# EAGLE design Snow_Melt_Map_2 (EAGLE 9.6.2)
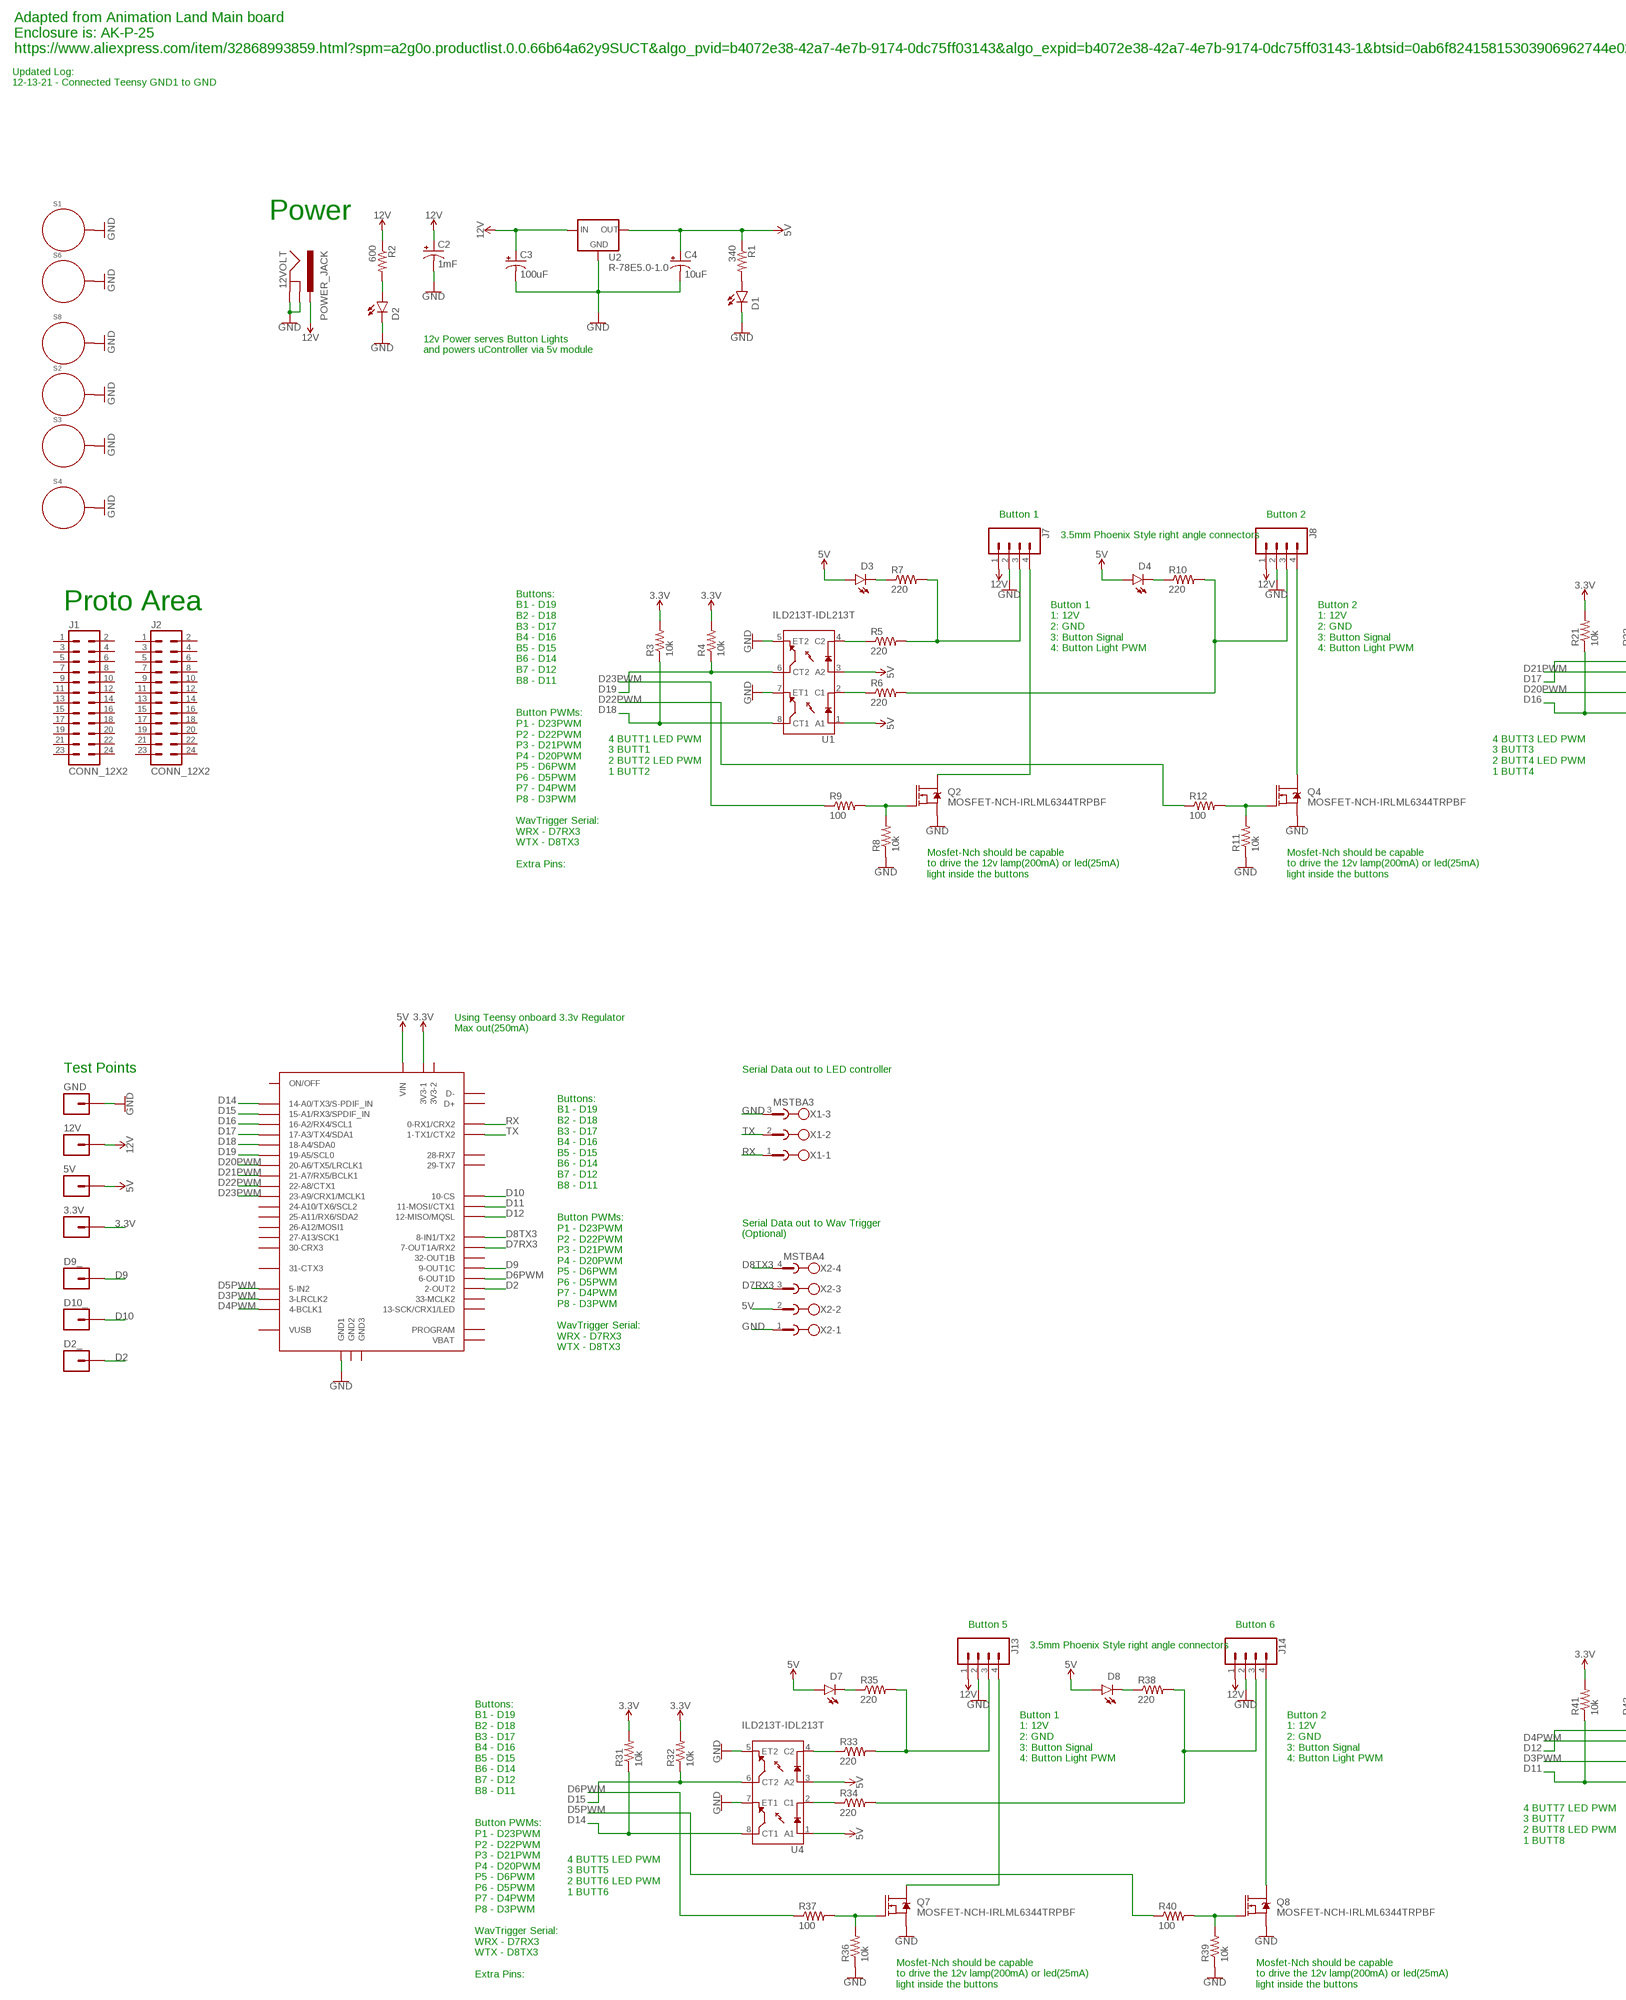
[diagram p0: schematic, sheet 1, part 1 of 2]
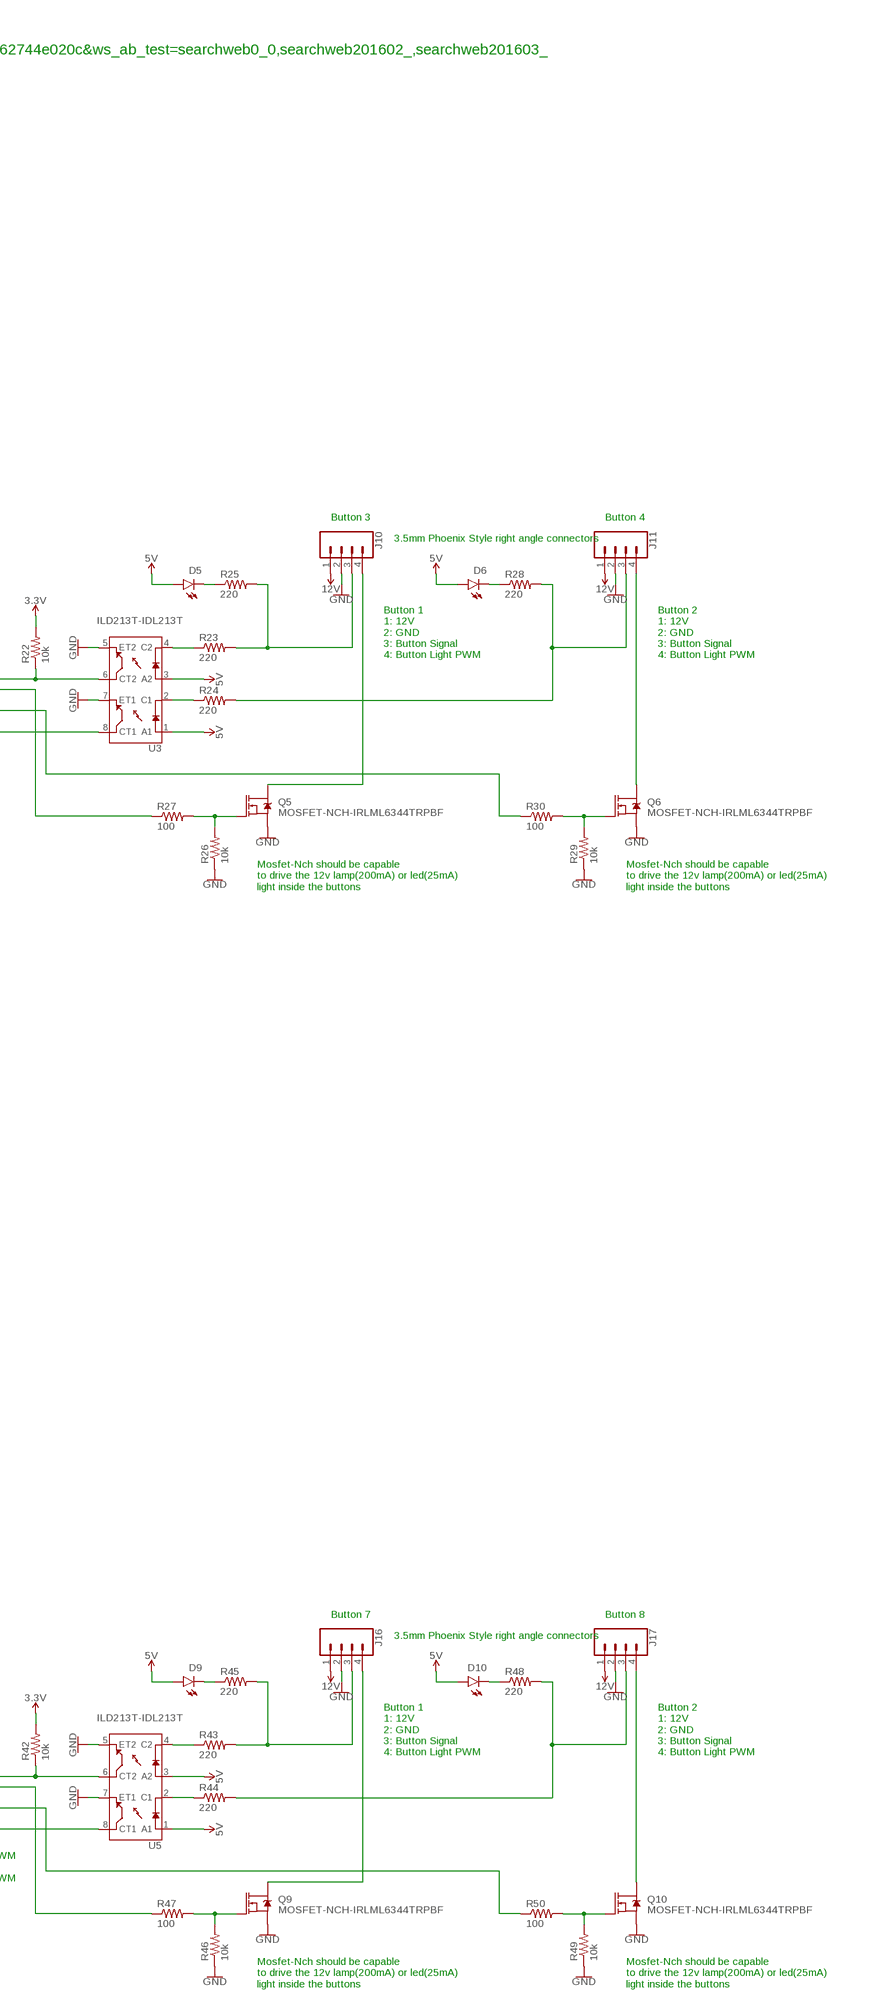
[diagram p1: schematic, sheet 1, part 2 of 2]

## Parts
3.3V  M01PTH  [1X01]
5V  M01PTH  [1X01]
12V  M01PTH  [1X01]
12VOLT  POWER_JACK  [POWER_JACK_PTH]
C2  1mF  1000UF-RADIAL-5MM-25V-20%  [CPOL-RADIAL-5MM-10MM]
C3  100uF  100UF-POLAR-RADIAL-2.5MM-25V-20%  [CPOL-RADIAL-2.5MM-6.5MM]
C4  10uF  10UF-POLAR-RADIAL-2.5MM-KIT-25V-20%  [CPOL-RADIAL-2.5MM-5MM-KIT]
D1  RED  LED-RED1206  [LED-1206]
D2  RED  LED-RED1206  [LED-1206]
D2_  M01PTH  [1X01]
D3  RED  LED-RED1206  [LED-1206]
D4  RED  LED-RED1206  [LED-1206]
D5  RED  LED-RED1206  [LED-1206]
D6  RED  LED-RED1206  [LED-1206]
D7  RED  LED-RED1206  [LED-1206]
D8  RED  LED-RED1206  [LED-1206]
D9  RED  LED-RED1206  [LED-1206]
D9_  M01PTH  [1X01]
D10  RED  LED-RED1206  [LED-1206]
D10_  M01PTH  [1X01]
GND  M01PTH  [1X01]
J1  CONN_12X2  [2X12]
J2  CONN_12X2  [2X12]
J7  CONN_043.5MM_RA  [1X04_3.5MM_RA]
J8  CONN_043.5MM_RA  [1X04_3.5MM_RA]
J10  CONN_043.5MM_RA  [1X04_3.5MM_RA]
J11  CONN_043.5MM_RA  [1X04_3.5MM_RA]
J13  CONN_043.5MM_RA  [1X04_3.5MM_RA]
J14  CONN_043.5MM_RA  [1X04_3.5MM_RA]
J16  CONN_043.5MM_RA  [1X04_3.5MM_RA]
J17  CONN_043.5MM_RA  [1X04_3.5MM_RA]
Q2  MOSFET-NCH-IRLML6344TRPBF  [SOT23-3]
Q4  MOSFET-NCH-IRLML6344TRPBF  [SOT23-3]
Q5  MOSFET-NCH-IRLML6344TRPBF  [SOT23-3]
Q6  MOSFET-NCH-IRLML6344TRPBF  [SOT23-3]
Q7  MOSFET-NCH-IRLML6344TRPBF  [SOT23-3]
Q8  MOSFET-NCH-IRLML6344TRPBF  [SOT23-3]
Q9  MOSFET-NCH-IRLML6344TRPBF  [SOT23-3]
Q10  MOSFET-NCH-IRLML6344TRPBF  [SOT23-3]
R1  340  R-US_R0805  [R0805]
R2  600  R-US_R0805  [R0805]
R3  10k  R-US_R0805  [R0805]
R4  10k  R-US_R0805  [R0805]
R5  220  R-US_R0805  [R0805]
R6  220  R-US_R0805  [R0805]
R7  220  R-US_R0805  [R0805]
R8  10k  R-US_R0805  [R0805]
R9  100  R-US_R0805  [R0805]
R10  220  R-US_R0805  [R0805]
R11  10k  R-US_R0805  [R0805]
R12  100  R-US_R0805  [R0805]
R21  10k  R-US_R0805  [R0805]
R22  10k  R-US_R0805  [R0805]
R23  220  R-US_R0805  [R0805]
R24  220  R-US_R0805  [R0805]
R25  220  R-US_R0805  [R0805]
R26  10k  R-US_R0805  [R0805]
R27  100  R-US_R0805  [R0805]
R28  220  R-US_R0805  [R0805]
R29  10k  R-US_R0805  [R0805]
R30  100  R-US_R0805  [R0805]
R31  10k  R-US_R0805  [R0805]
R32  10k  R-US_R0805  [R0805]
R33  220  R-US_R0805  [R0805]
R34  220  R-US_R0805  [R0805]
R35  220  R-US_R0805  [R0805]
R36  10k  R-US_R0805  [R0805]
R37  100  R-US_R0805  [R0805]
R38  220  R-US_R0805  [R0805]
R39  10k  R-US_R0805  [R0805]
R40  100  R-US_R0805  [R0805]
R41  10k  R-US_R0805  [R0805]
R42  10k  R-US_R0805  [R0805]
R43  220  R-US_R0805  [R0805]
R44  220  R-US_R0805  [R0805]
R45  220  R-US_R0805  [R0805]
R46  10k  R-US_R0805  [R0805]
R47  100  R-US_R0805  [R0805]
R48  220  R-US_R0805  [R0805]
R49  10k  R-US_R0805  [R0805]
R50  100  R-US_R0805  [R0805]
S1  STANDOFF_ELECTRICAL5-32  [STANDOFF_ELECTRICAL_5_32]
S2  STANDOFF_ELECTRICAL5-32  [STANDOFF_ELECTRICAL_5_32]
S3  STANDOFF_ELECTRICAL5-32  [STANDOFF_ELECTRICAL_5_32]
S4  STANDOFF_ELECTRICAL5-32  [STANDOFF_ELECTRICAL_5_32]
S6  STANDOFF_ELECTRICAL5-32  [STANDOFF_ELECTRICAL_5_32]
S8  STANDOFF_ELECTRICAL5-32  [STANDOFF_ELECTRICAL_5_32]
U1  ILD213T-IDL213T  [SO08]
U2  R-78E5.0-1.0  [DC-DC_CONVERTER_78XX]
U3  ILD213T-IDL213T  [SO08]
U4  ILD213T-IDL213T  [SO08]
U5  ILD213T-IDL213T  [SO08]
U$1  TEENSY40  [TEENSY40]
X1  MSTBA3  [MSTBA3]
X2  MSTBA4  [MSTBA4]

## Nets
3.3V: 3.3V.1 R3.2 R4.2 R21.2 R22.2 R31.2 R32.2 R41.2 R42.2 U$1.3V3-1
5V: 5V.1 C4.1(+) D3.A D4.A D5.A D6.A D7.A D8.A D9.A D10.A R1.1 U1.1(A1) U1.3(A2) U2.VOUT(OUT) U3.1(A1) U3.3(A2) U4.1(A1) U4.3(A2) U5.1(A1) U5.3(A2) U$1.VIN X2.2
12V: 12V.1 12VOLT.PWR C2.+ C3.1(+) J7.1 J8.1 J10.1 J11.1 J13.1 J14.1 J16.1 J17.1 R2.1 U2.VIN(IN)
D2: D2_.1 U$1.2-OUT2
D3PWM: R50.1 U$1.3-LRCLK2
D4PWM: R47.1 U$1.4-BCLK2(4-BCLK1)
D5PWM: R40.1 U$1.5-IN2
D6PWM: R37.1 U$1.6-OUT1D
D7RX3: U$1.7-RX2/OUT1A(7-OUT1A/RX2) X2.3
D8TX3: U$1.8-TX2/IN1(8-IN1/TX2) X2.4
D9: D9_.1 U$1.9-OUT1C
D10: D10_.1 U$1.10-CS/MQSR(10-CS)
D11: R41.1 U5.8(CT1) U$1.11-MOSI/CTX1
D12: R42.1 U5.6(CT2) U$1.12-MIO/MQSL(12-MISO/MQSL)
D14: R31.1 U4.8(CT1) U$1.14-A0/TX3/S-PFI_OUT(14-A0/TX3/S-PDIF_IN)
D15: R32.1 U4.6(CT2) U$1.15-A1/RX3/S-PDIF_IN(15-A1/RX3/SPDIF_IN)
D16: R21.1 U3.8(CT1) U$1.16-A2/RX4/SCL1
D17: R22.1 U3.6(CT2) U$1.17-A3/TX4/SDA1
D18: R3.1 U1.8(CT1) U$1.18-A4/SDA0
D19: R4.1 U1.6(CT2) U$1.19-A5/SCL0
D20PWM: R30.1 U$1.20-A6/TX5/LRCLK1
D21PWM: R27.1 U$1.21-A7/RX5/BCLK1
D22PWM: R12.1 U$1.22-A8/CTX1
D23PWM: R9.1 U$1.23-A9/CRX1/CCLK1(23-A9/CRX1/MCLK1)
GND: 12VOLT.GND 12VOLT.GNDBREAK C2.- C3.2(-) C4.2(-) D1.C D2.C GND.1 J7.2 J8.2 J10.2 J11.2 J13.2 J14.2 J16.2 J17.2 Q2.2(S) Q4.2(S) Q5.2(S) Q6.2(S) Q7.2(S) Q8.2(S) Q9.2(S) Q10.2(S) R8.1 R11.1 R26.1 R29.1 R36.1 R39.1 R46.1 R49.1 S1.P1 S2.P1 S3.P1 S4.P1 S6.P1 S8.P1 U1.5(ET2) U1.7(ET1) U2.GND U3.5(ET2) U3.7(ET1) U4.5(ET2) U4.7(ET1) U5.5(ET2) U5.7(ET1) U$1.GND1 X1.3 X2.1
N$2: D1.A R1.2
N$3: D2.A R2.2
N$5: J7.3 R5.2 R7.2
N$6: D3.C R7.1
N$7: R5.1 U1.4(C2)
N$8: R6.1 U1.2(C1)
N$10: Q2.1(G) R8.2 R9.2
N$11: J7.4 Q2.3(D)
N$12: J8.3 R6.2 R10.2
N$18: D4.C R10.1
N$25: Q4.1(G) R11.2 R12.2
N$28: J8.4 Q4.3(D)
N$31: J10.3 R23.2 R25.2
N$32: D5.C R25.1
N$33: R23.1 U3.4(C2)
N$34: R24.1 U3.2(C1)
N$35: Q5.1(G) R26.2 R27.2
N$36: J10.4 Q5.3(D)
N$37: J11.3 R24.2 R28.2
N$38: D6.C R28.1
N$39: Q6.1(G) R29.2 R30.2
N$42: J11.4 Q6.3(D)
N$45: J13.3 R33.2 R35.2
N$46: D7.C R35.1
N$47: R33.1 U4.4(C2)
N$48: R34.1 U4.2(C1)
N$49: Q7.1(G) R36.2 R37.2
N$50: J13.4 Q7.3(D)
N$51: J14.3 R34.2 R38.2
N$52: D8.C R38.1
N$53: Q8.1(G) R39.2 R40.2
N$56: J14.4 Q8.3(D)
N$59: J16.3 R43.2 R45.2
N$60: D9.C R45.1
N$61: R43.1 U5.4(C2)
N$62: R44.1 U5.2(C1)
N$63: Q9.1(G) R46.2 R47.2
N$64: J16.4 Q9.3(D)
N$65: J17.3 R44.2 R48.2
N$66: D10.C R48.1
N$67: Q10.1(G) R49.2 R50.2
N$70: J17.4 Q10.3(D)
RX: U$1.0-RX1(0-RX1/CRX2) X1.1
TX: U$1.1-TX1(1-TX1/CTX2) X1.2
Unconnected: J1.1 J1.2 J1.3 J1.4 J1.5 J1.6 J1.7 J1.8 J1.9 J1.10 J1.11 J1.12 J1.13 J1.14 J1.15 J1.16 J1.17 J1.18 J1.19 J1.20 J1.21 J1.22 J1.23 J1.24 J2.1 J2.2 J2.3 J2.4 J2.5 J2.6 J2.7 J2.8 J2.9 J2.10 J2.11 J2.12 J2.13 J2.14 J2.15 J2.16 J2.17 J2.18 J2.19 J2.20 J2.21 J2.22 J2.23 J2.24 U$1.3V3-2 U$1.13-SCK/CRX1/LED U$1.24-A10/TX6/SCL2 U$1.25-A11/SDA2(25-A11/RX6/SDA2) U$1.26-A12/MOSI1 U$1.27-A13/SCK1 U$1.28-RX7 U$1.29-TX7 U$1.30-CRX3 U$1.31-CTX3 U$1.32-OUTB1(32-OUT1B) U$1.33-MCLK2 U$1.D+ U$1.D- U$1.GND2 U$1.GND3 U$1.ON/OFF U$1.PROGRAM U$1.VBAT U$1.VUSB

## Notes on the sheet
- Adapted from Animation Land Main board
  Enclosure is: AK-P-25
  https://www.aliexpress.com/item/32868993859.html?spm=a2g0o.productlist.0.0.66b64a62y9SUCT&algo_pvid=b4072e38-42a7-4e7b-9174-0dc75ff03143&algo_expid=b4072e38-42a7-4e7b-9174-0dc75ff03143-1&btsid=0ab6f82415815303906962744e020c&ws_ab_test=searchweb0_0,searchweb201602_,searchweb201603_
- Updated Log:
  12-13-21 - Connected Teensy GND1 to GND
- Power
- 12v Power serves Button Lights
  and powers uController via 5v module
- Button 3 | Button 4
- Button 1 | Button 2
- 3.5mm Phoenix Style right angle connectors
- 3.5mm Phoenix Style right angle connectors
- Proto Area
- Button 1
  1: 12V
  2: GND
  3: Button Signal
  4: Button Light PWM
- Button 2
  1: 12V
  2: GND
  3: Button Signal
  4: Button Light PWM
- Button 1
  1: 12V
  2: GND
  3: Button Signal
  4: Button Light PWM
- Button 2
  1: 12V
  2: GND
  3: Button Signal
  4: Button Light PWM
- 4 BUTT1 LED PWM
  3 BUTT1
  2 BUTT2 LED PWM
  1 BUTT2
- 4 BUTT3 LED PWM
  3 BUTT3
  2 BUTT4 LED PWM
  1 BUTT4
- Buttons:
  B1 - D19
  B2 - D18
  B3 - D17
  B4 - D16
  B5 - D15
  B6 - D14
  B7 - D12
  B8 - D11
  
  
  Button PWMs:
  P1 - D23PWM
  P2 - D22PWM
  P3 - D21PWM
  P4 - D20PWM
  P5 - D6PWM
  P6 - D5PWM
  P7 - D4PWM
  P8 - D3PWM
  
  WavTrigger Serial:
  WRX - D7RX3
  WTX - D8TX3
  
  Extra Pins:
- Mosfet-Nch should be capable
  to drive the 12v lamp(200mA) or led(25mA)
  light inside the buttons
- Mosfet-Nch should be capable
  to drive the 12v lamp(200mA) or led(25mA)
  light inside the buttons
- Mosfet-Nch should be capable
  to drive the 12v lamp(200mA) or led(25mA)
  light inside the buttons
- Mosfet-Nch should be capable
  to drive the 12v lamp(200mA) or led(25mA)
  light inside the buttons
- Using Teensy onboard 3.3v Regulator 
  Max out(250mA)
- Test Points | Serial Data out to LED controller
- Serial Data out to Wav Trigger
  (Optional)
- Buttons:
  B1 - D19
  B2 - D18
  B3 - D17
  B4 - D16
  B5 - D15
  B6 - D14
  B7 - D12
  B8 - D11
  
  
  Button PWMs:
  P1 - D23PWM
  P2 - D22PWM
  P3 - D21PWM
  P4 - D20PWM
  P5 - D6PWM
  P6 - D5PWM
  P7 - D4PWM
  P8 - D3PWM
  
  WavTrigger Serial:
  WRX - D7RX3
  WTX - D8TX3
- Button 7 | Button 8
- 3.5mm Phoenix Style right angle connectors
- Button 5 | Button 6
- 3.5mm Phoenix Style right angle connectors
- Button 1
  1: 12V
  2: GND
  3: Button Signal
  4: Button Light PWM
- Button 2
  1: 12V
  2: GND
  3: Button Signal
  4: Button Light PWM
- Button 1
  1: 12V
  2: GND
  3: Button Signal
  4: Button Light PWM
- Button 2
  1: 12V
  2: GND
  3: Button Signal
  4: Button Light PWM
- 4 BUTT7 LED PWM
  3 BUTT7
  2 BUTT8 LED PWM
  1 BUTT8
- 4 BUTT5 LED PWM
  3 BUTT5
  2 BUTT6 LED PWM
  1 BUTT6
- Mosfet-Nch should be capable
  to drive the 12v lamp(200mA) or led(25mA)
  light inside the buttons
- Mosfet-Nch should be capable
  to drive the 12v lamp(200mA) or led(25mA)
  light inside the buttons
- Buttons:
  B1 - D19
  B2 - D18
  B3 - D17
  B4 - D16
  B5 - D15
  B6 - D14
  B7 - D12
  B8 - D11
  
  
  Button PWMs:
  P1 - D23PWM
  P2 - D22PWM
  P3 - D21PWM
  P4 - D20PWM
  P5 - D6PWM
  P6 - D5PWM
  P7 - D4PWM
  P8 - D3PWM
  
  WavTrigger Serial:
  WRX - D7RX3
  WTX - D8TX3
  
  Extra Pins:
- Mosfet-Nch should be capable
  to drive the 12v lamp(200mA) or led(25mA)
  light inside the buttons
- Mosfet-Nch should be capable
  to drive the 12v lamp(200mA) or led(25mA)
  light inside the buttons

## Library data of the parts
3.3V 5V 12V D2_ D9_ D10_ GND = SparkFun-Connectors:M01: Header 1 Standard 1-pin 0.1" header. Use with straight break away headers (SKU : PRT-00116), right angle break away headers (PRT-00553), swiss pins (PRT-00743), machine pins (PRT-00117), and female headers (PRT-00115). SMTSO-256-ET is a "flush mount" nut for a 4-40 screw. The older package used to be too tight, and did not allow it to sit properly thru the drill hit. The latest (0.165DIA) fits nice and snug.
12VOLT = SparkFun-Connectors:POWER_JACK: Power Jack Connector This is the standard 5.5mm barrel jack for power. The PTH is the most common, proven, reliable, footprint. The Slot footprint only works if the mill layer is transmitted to the PCB fab house so be warned. Here are the connectors we sell at SparkFun: DC Barrel Power Jack/Connector <https://www.sparkfun.com/products/119> (PRT-00119) DC Barrel Power Jack/Connector (SMD) <https://www.sparkfun.com/products/12748> (PRT-12748) DC Barrel Jack Adapter - Breadboard Compatible <https://www.sparkfun.com/products/10811> (PRT-10811) It is used on this SparkFun product (and many, many others): SparkFun RedBoard - Programmed with Arduino <https://www.sparkfun.com/products/12757> (DEV-12757) Also, if you need a mating power supply or connector, please check these out: Wall Adapter Power Supply - 9VDC 650mA <https://www.sparkfun.com/products/298> (TOL-00298) DC Barrel Jack Adapter - Male <https://www.sparkfun.com/products/10287> (PRT-10287); PROD_ID: CONN-08197
C2 = SparkFun-Capacitors:1000UF: 1,000µF/1mF ceramic capacitors A capacitor is a passive two-terminal electrical component used to store electrical energy temporarily in an electric field. CAP-08070; PROD_ID: CAP-09538
C3 = SparkFun-Capacitors:100UF-POLAR: 100µF polarized capacitors A capacitor is a passive two-terminal electrical component used to store electrical energy temporarily in an electric field.; PROD_ID: CAP-08439
C4 = SparkFun-Capacitors:10UF-POLAR: 10.0µF polarized capacitors A capacitor is a passive two-terminal electrical component used to store electrical energy temporarily in an electric field.; PROD_ID: CAP-08440
D1-D10 = SparkFun-LED:LED-RED: Red SMD LED Used in manufacturing of most products at SparkFun Packages: 0603 - SMD 0603 package [Product Link] <http://docs.avagotech.com/docs/AV02-0551EN> 0603 SMART - SMD 0603 SMART package ( more efficient and expensive)[Product Link] <http://www.osram-os.com/Graphics/XPic2/00077099_0.pdf> 1206 - SMD1206 package [Product Link] <https://www.sparkfun.com/datasheets/DevTools/LilyPad/Q150OVS4.pdff> SparkFun Products: Pro Mini 328 -5V <https://www.sparkfun.com/products/821> RedBoard <https://www.sparkfun.com/products/12757> IOIO-OTG <https://www.sparkfun.com/products/13613>; PROD_ID: DIO-09912
J1 J2 = SparkFun-Connectors:CONN_12X2: Multi connection point. Often used as Generic Header-pin footprint for 0.1 inch spaced/style header connections On any of the 0.1 inch spaced packages, you can populate with these: Break Away Headers - Straight <https://www.sparkfun.com/products/116> (PRT-00116) Break Away Male Headers - Right Angle <https://www.sparkfun.com/products/553> (PRT-00553) Female Headers <https://www.sparkfun.com/products/115> (PRT-00115) Break Away Headers - Machine Pin <https://www.sparkfun.com/products/117> (PRT-00117) Break Away Female Headers - Swiss Machine Pin <https://www.sparkfun.com/products/743> (PRT-00743)
J7 J8 J10 J11 J13 J14 J16 J17 = th_libraries:CONN_04: Multi connection point. Often used as Generic Header-pin footprint for 0.1 inch spaced/style header connections On any of the 0.1 inch spaced packages, you can populate with these: Break Away Headers - Straight <https://www.sparkfun.com/products/116> (PRT-00116) Break Away Male Headers - Right Angle <https://www.sparkfun.com/products/553> (PRT-00553) Female Headers <https://www.sparkfun.com/products/115> (PRT-00115) Break Away Headers - Machine Pin <https://www.sparkfun.com/products/117> (PRT-00117) Break Away Female Headers - Swiss Machine Pin <https://www.sparkfun.com/products/743> (PRT-00743) For SCREWTERMINALS and SPRING TERMINALS visit here: Screw Terimnals on SparkFun.com <https://www.sparkfun.com/search/results?term=Screw+Terminals> (5mm/3.5mm/2.54mm spacing) This device is also useful as a general connection point to wire up your design to another part of your project. Our various solder wires solder well into these plated through hole pads. Hook-Up Wire - Assortment (Stranded, 22 AWG) <https://www.sparkfun.com/products/11375> (PRT-11375) Hook-Up Wire - Assortment (Solid Core, 22 AWG) <https://www.sparkfun.com/products/11367> (PRT-11367) View the entire wire category on our website here <https://www.sparkfun.com/categories/141> Special notes: Molex polarized connector foot print use with SKU : PRT-08231 with associated crimp pins and housings. 1MM SMD Version SKU: PRT-10208
Q2 Q4-Q10 = th_libraries:MOSFET-NCH: N-channel MOSFETs from Sparkfun-DiscreteSemi Library; DESC: 5.0A/29mOhm/30V/2.5V drv capable
R1-R12 R21-R50 = rcl:R-US_: RESISTOR, American symbol; SPICEPREFIX: R
S1-S4 S6 S8 = th_libraries:STANDOFF_ELECTRICAL: A standoff intended to be an electrically connected point. Pad size and stop size allow for a #8 Phillips pan screw head to make a solid connection to the board. Added 144mill drill hole that fits my normal wood screw
U1 U3-U5 = th_libraries:ILD213T: Dual Channel Phototransistor Optocoupler Dual Channel 70 V 4000 Vrms Phototransistor Optocoupler in a standard SOIC-8 package. Used to couple signals between electrically isolated circuits. Datasheet <https://www.sparkfun.com/datasheets/Components/SMD/ild205t.pdf> SparkFun Products: SparkFun Opto-Isolator Breakout <https://www.sparkfun.com/products/9118>; PROD_ID: IC-09076
U2 = SparkFun-IC-Power:R-78E5.0-1.0: Recom Power 5V 1A DC/DC Converter The Recom R-78E5.0-X.X is a compact DC/DC converter module that is a pin for pin drop-in replacement for the LM7805 linear voltage regulator. Specifications: Input Range: 7-28V Output Voltage: 5V Output Current: 1A Max Efficiency: 91% Datasheet <https://www.recom-power.com/pdf/Innoline/R-78Exx-1.0.pdf>; PROD_ID: COM-13655
U$1 = th_libraries:TEENSY40: Teensy 4.0 device including POGO pins for pins 24 - 33, but not yet pins for D+ and D-. Symbol layout is what works for me and may not suite everyone... that can be added or additional symbols can be created to be used in a modilied davie name.
X1 = th_libraries:MSTBA3: PHOENIX; MF: FARNELL; MPN: 1757255; OC_FARNELL: 3705183; OC_NEWARK: 71C4162
X2 = th_libraries:MSTBA4: PHOENIX; MF: FARNELL; MPN: 1757268; OC_FARNELL: 3705195; OC_NEWARK: 71C4163

## Board
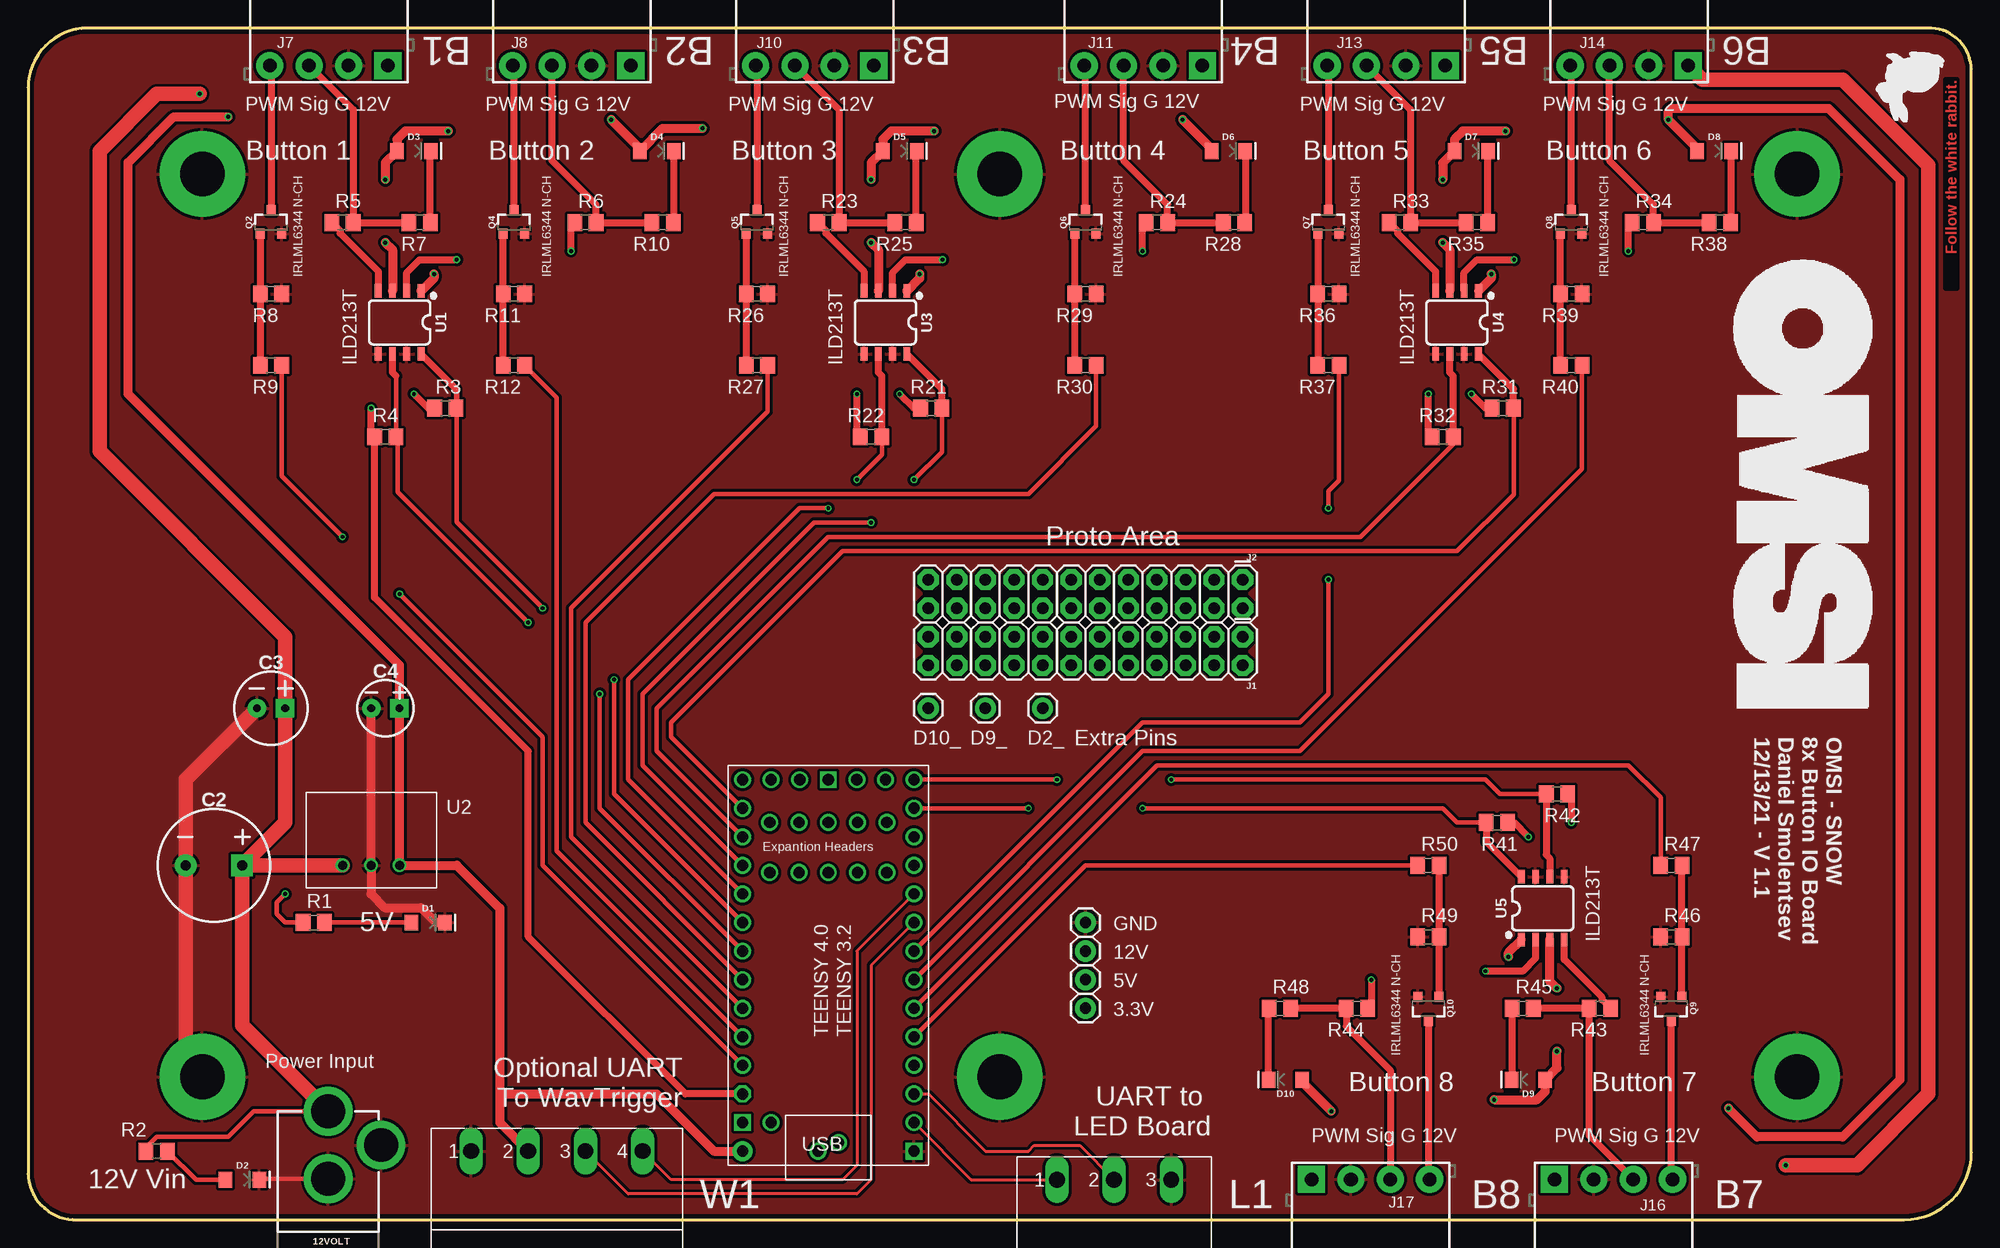
[diagram p2: board, top side]
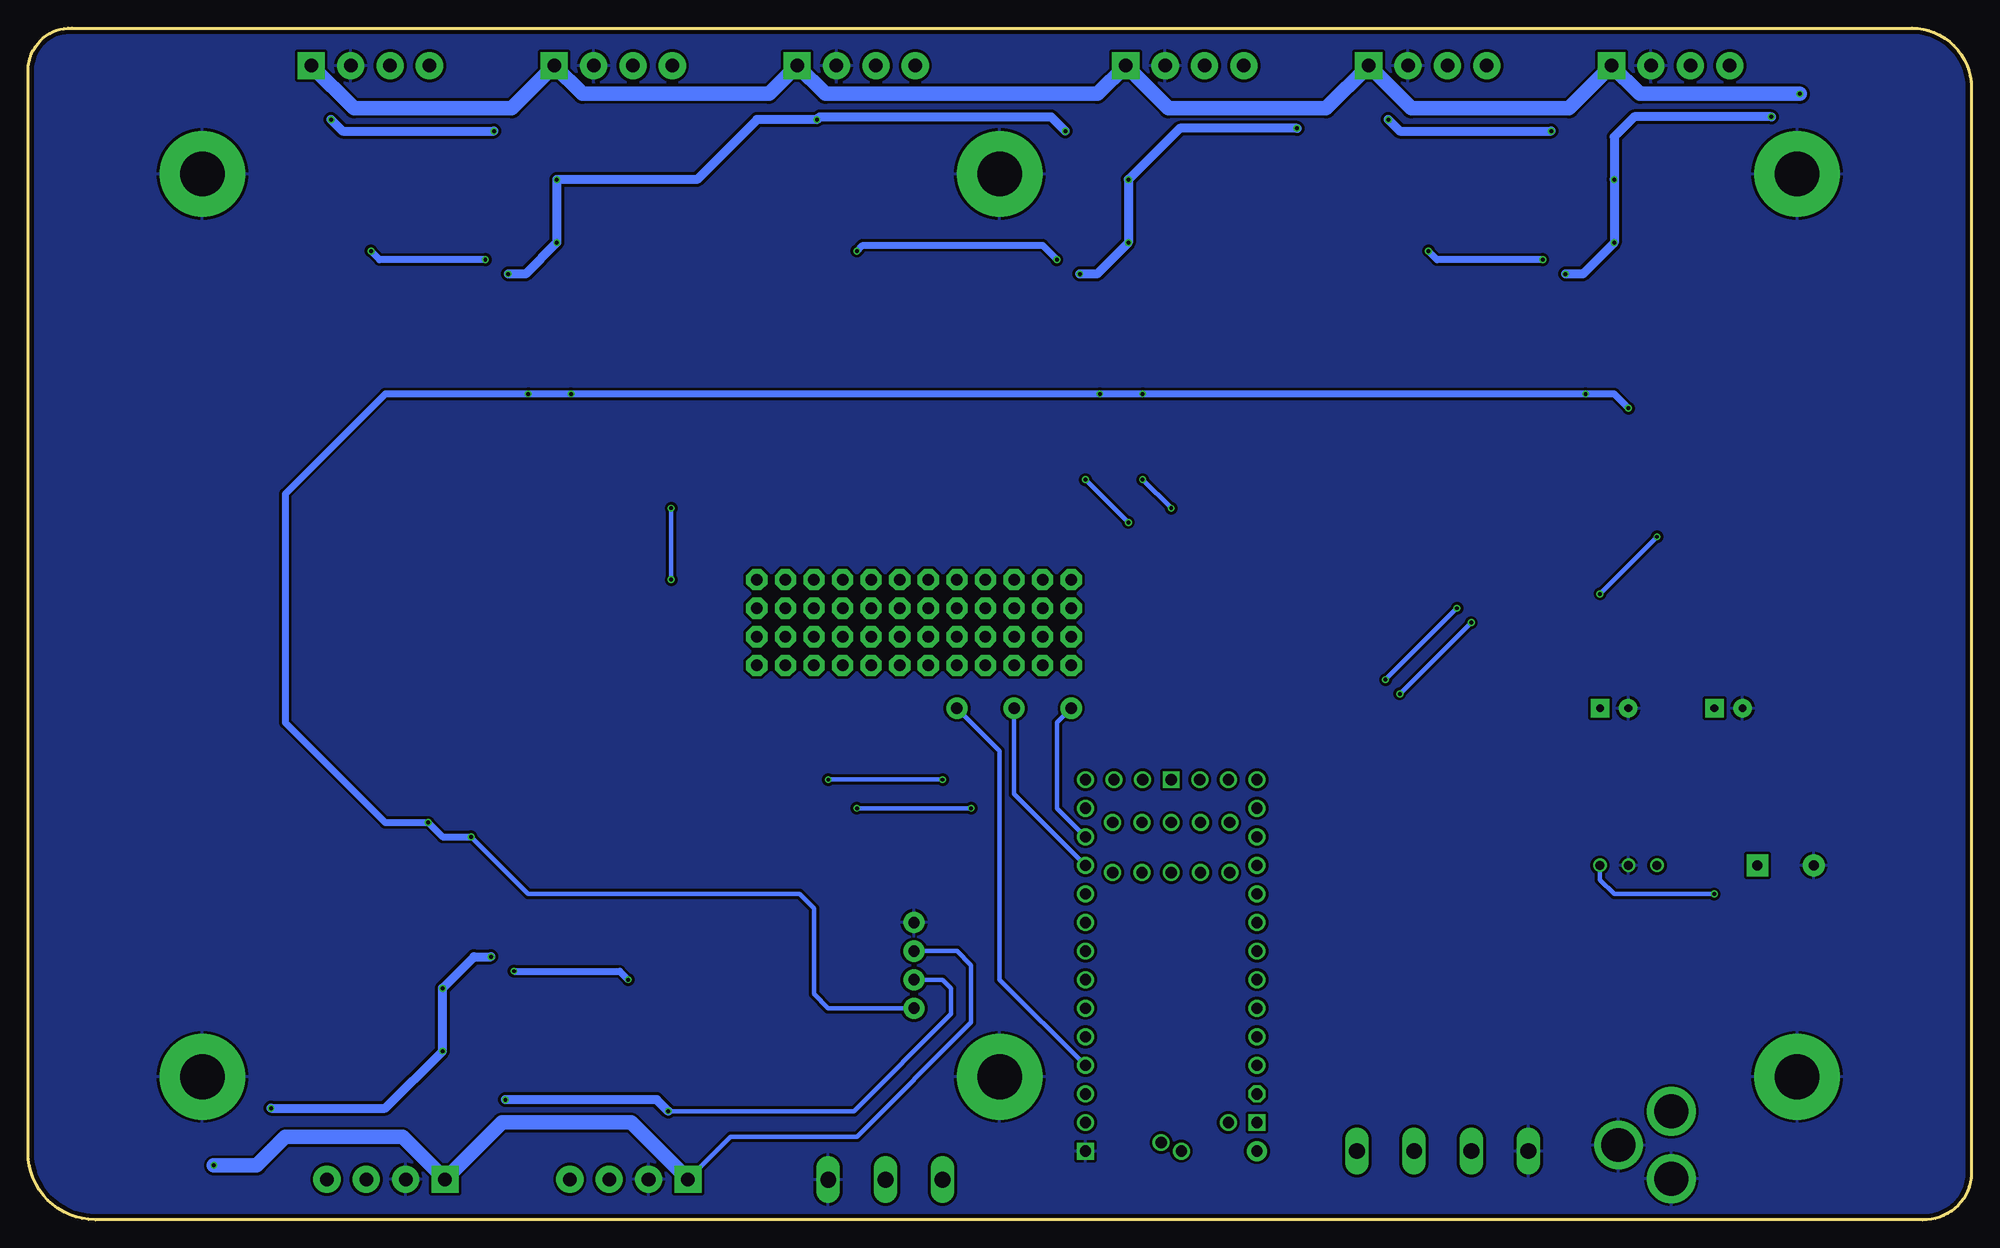
[diagram p3: board, bottom side, seen from below]

Size 172.72 x 105.93 mm. Coordinates in mm from the lower left corner, seen from the top.
Outline: 168.83,105.93 5.28,105.93 arc90 0,100.65 0,4.09 arc90 4.33,0 166.75,0 arc90 172.72,5.98 172.72,102.29 arc90 168.83,105.93
Copper layers (1*16): Top 0.035559375mm / dielectric 1.6mm / Bottom 0.035559375mm
Design rules "oshpark-2layer (1) *": minimum track width 10mil, minimum drill 10mil, track to track 8mil, track to pad 8mil, pad to pad 8mil, via to via 8mil, smd to smd 8mil, copper to edge 15mil, drill to drill 6mil, minimum pad ring 5mil, minimum via ring 5mil, stop-mask expansion 2.5mil, vias tented up to drill 25mil, thermal gap 10mil

### Footprints (pad centres in the part's own frame; a part is rotated, then mirrored left to right if it is on the bottom)
1X01 = drill 1.016 pad 1.88: 1 0,0
POWER_JACK_PTH = drill 2.997 pad 4.318: GND 0,7.7; GNDBREAK 4.7,10.7; PWR 0,13.7
CPOL-RADIAL-5MM-10MM = drill 0.9 pad 1.93 square: + 2.5,0 | drill 0.9 pad 1.93: - -2.5,0
CPOL-RADIAL-2.5MM-6.5MM = drill 0.7 pad 1.651 square: 1 1.25,0 | drill 0.7 pad 1.651: 2 -1.25,0
CPOL-RADIAL-2.5MM-5MM-KIT = drill 0.7 pad 1.651 square: 1 1.25,0 | drill 0.7 pad 1.651: 2 -1.25,0
LED-1206 = smd 1.2 x 1.4: A -1.5,0; C 1.5,0
2X12 = drill 1.016 pad 1.88 octagon: 1 0,0; 2 0,2.54; 3 2.54,0; 4 2.54,2.54; 5 5.08,0; 6 5.08,2.54; 7 7.62,0; 8 7.62,2.54; 9 10.16,0; 10 10.16,2.54; 11 12.7,0; 12 12.7,2.54; 13 15.24,0; 14 15.24,2.54; 15 17.78,0; 16 17.78,2.54; 17 20.32,0; 18 20.32,2.54; 19 22.86,0; 20 22.86,2.54; 21 25.4,0; 22 25.4,2.54; 23 27.94,0; 24 27.94,2.54
1X04_3.5MM_RA = drill 1.2 pad 2.413 square: 1 -0.228,0.023 | drill 1.2 pad 2.413: 2 3.272,0.023; 3 6.772,0.023; 4 10.272,0.023
SOT23-3 = smd 0.8 x 0.9: 1 -0.95,-1; 2 0.95,-1; 3 0,1.1
R0805 = smd 1.3 x 1.5: 1 -0.95,0; 2 0.95,0
STANDOFF_ELECTRICAL_5_32 = drill 3.969 pad 7.62: P1 0,0
SO08 = smd 0.6 x 1.2: 1 -1.905,-2.8; 2 -0.635,-2.8; 3 0.635,-2.8; 4 1.905,-2.8; 5 1.905,2.8; 6 0.635,2.8; 7 -0.635,2.8; 8 -1.905,2.8
DC-DC_CONVERTER_78XX = drill 0.8: GND 0,0; VIN -2.54,0; VOUT 2.54,0
TEENSY40 = drill 1: 0-RX1 -13.97,-7.62; 1-TX1 -11.43,-7.62; 2-OUT2 -8.89,-7.62; 3-LRCLK2 -6.35,-7.62; 3V3-2 16.51,-2.54; 4-BCLK2 -3.81,-7.62; 5-IN2 -1.27,-7.62; 6-OUT1D 1.27,-7.62; 7-RX2/OUT1A 3.81,-7.62; 8-TX2/IN1 6.35,-7.62; 9-OUT1C 8.89,-7.62; 10-CS/MQSR 11.43,-7.62; 11-MOSI/CTX1 13.97,-7.62; 12-MIO/MQSL 16.51,-7.62; 13-SCK/CRX1/LED 16.51,7.62; 14-A0/TX3/S-PFI_OUT 13.97,7.62; 15-A1/RX3/S-PDIF_IN 11.43,7.62; 16-A2/RX4/SCL1 8.89,7.62; 17-A3/TX4/SDA1 6.35,7.62; 18-A4/SDA0 3.81,7.62; 19-A5/SCL0 1.27,7.62; 20-A6/TX5/LRCLK1 -1.27,7.62; 21-A7/RX5/BCLK1 -3.81,7.62; 22-A8/CTX1 -6.35,7.62; 23-A9/CRX1/CCLK1 -8.89,7.62; 24-A10/TX6/SCL2 12.7,5.207; 25-A11/SDA2 8.255,5.207; 26-A12/MOSI1 12.7,2.603; 27-A13/SCK1 8.255,2.603; 28-RX7 12.7,0; 29-TX7 8.255,0; 30-CRX3 12.7,-2.603; 31-CTX3 8.255,-2.603; 32-OUTB1 12.7,-5.207; 33-MCLK2 8.255,-5.207; D+ -15.75,-0.9; D- -16.51,0.9; ON/OFF 16.51,5.08; PROGRAM 16.51,2.54; VBAT 16.51,-5.08; VUSB -13.97,5.08 | drill 1 octagon: 3V3-1 -11.43,7.62 | drill 1 square: GND1 -16.51,-7.62; GND2 16.51,0; GND3 -13.97,7.62 | drill 1 pad 1.778: VIN -16.51,7.62
MSTBA3 = drill 1.397 long: 1 -5.08,5.08; 2 0,5.08; 3 5.08,5.08
MSTBA4 = drill 1.397 long: 1 -7.62,5.08; 2 -2.54,5.08; 3 2.54,5.08; 4 7.62,5.08

### Placement (x,y rotation side)
3.3V  93.98,18.8 0 top
5V  93.98,21.34 0 top
12V  93.98,23.88 0 top
12VOLT  26.67,-4.06 0 top
C2  16.51,31.5 0 top
C3  21.59,45.47 0 top
C4  31.75,45.47 0 top
D1  35.56,26.42 0 top
D2  19.05,3.56 0 top
D2_  90.17,45.47 0 top
D3  34.29,95 0 top
D4  55.88,95 0 top
D5  77.47,95 0 top
D6  106.68,95 0 top
D7  128.27,95 0 top
D8  149.86,95 0 top
D9  133.35,12.45 180 top
D9_  85.09,45.47 0 top
D10  111.76,12.45 180 top
D10_  80.01,45.47 0 top
GND  93.98,26.42 0 top
J1  107.95,51.82 180 top
J2  107.95,56.9 180 top
J7  31.75,102.62 180 top
J8  53.34,102.62 180 top
J10  74.93,102.62 180 top
J11  104.14,102.62 180 top
J13  125.73,102.62 180 top
J14  147.32,102.62 180 top
J16  135.89,3.56 0 top
J17  114.3,3.56 0 top
Q2  21.59,88.65 0 top
Q4  43.18,88.65 0 top
Q5  64.77,88.65 0 top
Q6  93.98,88.65 0 top
Q7  115.57,88.65 0 top
Q8  137.16,88.65 0 top
Q9  146.05,18.8 180 top
Q10  124.46,18.8 180 top
R1  25.4,26.42 0 top
R2  11.43,6.1 0 top
R3  37.08,72.14 180 top
R4  31.75,69.6 180 top
R5  27.94,88.65 0 top
R6  49.53,88.65 0 top
R7  34.8,88.65 180 top
R8  21.59,82.3 180 top
R9  21.59,75.95 180 top
R10  56.39,88.65 180 top
R11  43.18,82.3 180 top
R12  43.18,75.95 180 top
R21  80.26,72.14 180 top
R22  74.93,69.6 180 top
R23  71.12,88.65 0 top
R24  100.33,88.65 0 top
R25  77.98,88.65 180 top
R26  64.77,82.3 180 top
R27  64.77,75.95 180 top
R28  107.19,88.65 180 top
R29  93.98,82.3 180 top
R30  93.98,75.95 180 top
R31  131.06,72.14 180 top
R32  125.73,69.6 180 top
R33  121.92,88.65 0 top
R34  143.51,88.65 0 top
R35  128.78,88.65 180 top
R36  115.57,82.3 180 top
R37  115.57,75.95 180 top
R38  150.37,88.65 180 top
R39  137.16,82.3 180 top
R40  137.16,75.95 180 top
R41  130.56,35.31 0 top
R42  135.89,37.85 0 top
R43  139.7,18.8 180 top
R44  118.11,18.8 180 top
R45  132.84,18.8 0 top
R46  146.05,25.15 0 top
R47  146.05,31.5 0 top
R48  111.25,18.8 0 top
R49  124.46,25.15 0 top
R50  124.46,31.5 0 top
S1  15.49,92.97 0 top
S2  86.36,92.97 0 top
S3  157.23,12.71 0 top
S4  157.23,92.97 0 top
S6  86.36,12.71 0 top
S8  15.49,12.71 0 top
U1  33.02,79.76 180 top
U2  30.48,31.5 0 top
U3  76.2,79.76 180 top
U4  127,79.76 180 top
U5  134.62,27.69 0 top
U$1  71.12,22.61 90 top
X1  96.52,-1.52 0 top
X2  46.99,1.02 0 top

### Tracks (layer width: path | path; a pad name or v marks a point on that pad's centre or on a via)
3.3V  (via drill 0.35)
  Top 0.61: v30.48,72.14 30.48,69.92 R4.2 30.8,55.31 44.45,41.66 44.45,25.15 58.42,11.18 U$1.3V3-1 | v34.29,73.41 35.56,72.14 R3.2 | R22.2 73.66,69.92 v73.66,73.41 | v77.47,73.41 78.74,72.14 R21.2 | R32.2 124.46,69.92 v124.46,73.41 | v128.27,73.41 129.54,72.14 R31.2 | R42.2 137.16,37.53 v137.16,35.31 | v133.35,34.04 132.08,35.31 R41.2
  Bottom 0.406: v133.35,34.04 128.27,28.96 104.14,28.96 102.87,27.69 102.87,20.07 101.6,18.8 3.3V.1
  Bottom 0.61: v30.48,72.14 31.75,73.41 v34.29,73.41 v73.66,73.41 v77.47,73.41 v124.46,73.41 v128.27,73.41 140.97,73.41 149.86,64.52 149.86,44.2 140.97,35.31 v137.16,35.31 135.89,34.04 v133.35,34.04
5V  (via drill 0.35)
  Top 0.406: R1.1 22.86,26.42 22.1,27.19 22.1,28.2 v22.86,28.96
  Top 0.813: v51.82,97.8 54.38,95.23 D4.A 56.41,97.04 v59.94,97.04 | v37.34,96.78 33.53,96.78 32.79,96.04 D3.A 31.75,93.96 v31.75,92.46 | v31.75,86.88 32.38,86.24 U1.3 | v36.07,84.08 36.07,83.71 U1.1 | D6.A 105.18,95.23 v102.62,97.8 | v80.52,96.78 76.71,96.78 75.97,96.04 D5.A 74.93,93.96 v74.93,92.46 | v74.93,86.88 75.56,86.24 U3.3 | v79.25,84.08 79.25,83.71 U3.1 | D8.A 148.36,95.23 v145.8,97.8 145.8,98.56 146.05,98.81 160.02,98.81 166.37,92.46 166.37,12.45 161.29,7.37 153.67,7.37 v151.13,9.91 | v131.32,96.78 127.51,96.78 126.77,96.04 D7.A 125.73,93.96 v125.73,92.46 | v125.73,86.88 126.37,86.24 U4.3 | v130.05,84.08 130.05,83.71 U4.1 | D10.A 113.26,12.22 v115.82,9.66 | v130.3,10.68 134.11,10.68 134.85,11.41 D9.A 135.89,13.49 v135.89,14.99 | v135.89,20.58 135.25,21.22 U5.3 | v131.57,23.38 131.57,23.75 U5.1 | X2.2 41.91,8.64 41.91,11.18 | 41.91,11.18 41.91,27.69 38.1,31.5 U2.VOUT 33.02,45.45 C4.1 33,49.26 33.02,49.28 8.89,73.41 8.89,93.99 12.95,98.05 v17.78,98.05 | 41.91,11.18 55.88,11.18 60.96,6.1 U$1.VIN
  Bottom 0.406: U2.VOUT 33.02,30.23 31.75,28.96 v22.86,28.96 | 5V.1 91.44,21.34 90.68,20.58 90.68,18.3 99.31,9.66 v115.82,9.66
  Bottom 0.813: v51.82,97.8 50.8,96.78 v37.34,96.78 | v36.07,84.08 34.54,84.08 v31.75,86.88 v31.75,92.46 31.75,96.27 29.97,98.05 v17.78,98.05 | v80.52,96.78 81.79,98.05 102.36,98.05 v102.62,97.8 107.95,97.8 113.28,92.46 v125.73,92.46 v125.73,86.88 128.52,84.08 v130.05,84.08 | v79.25,84.08 77.72,84.08 v74.93,86.88 v74.93,92.46 70.36,97.04 v59.94,97.04 | v145.8,97.8 144.78,96.78 v131.32,96.78 | v115.82,9.66 116.84,10.68 v130.3,10.68 | v131.57,23.38 133.1,23.38 v135.89,20.58 v135.89,14.99 140.97,9.91 v151.13,9.91
12V  (via drill 0.35)
  Top 0.406: 12VOLT.PWR 20.05,9.64 17.78,7.37 11.43,7.37 10.48,6.42 R2.1
  Top 1.27: U2.VIN C2.+ | C2.+ 22.84,35.33 C3.1 22.84,51.8 22.86,51.82 6.35,68.33 6.35,95 11.43,100.08 v15.24,100.08 | J14.1 148.8,101.35 161.29,101.35 168.91,93.73 168.91,11.18 162.56,4.83 v156.21,4.83 | 12VOLT.PWR 19.01,17.3 C2.+
  Bottom 0.406: J17.1 110.28,7.37 99.06,7.37 88.9,17.53 88.9,22.61 90.17,23.88 12V.1
  Bottom 1.27: J14.1 143.76,98.81 129.75,98.81 J13.1 123.44,100.08 106.88,100.08 J11.1 101.85,100.08 77.68,100.08 J10.1 71.37,98.81 57.35,98.81 J8.1 49.78,98.81 35.77,98.81 J7.1 29.46,100.08 v15.24,100.08 | J17.1 119.13,8.64 130.6,8.64 J16.1 139.45,7.37 149.86,7.37 152.4,4.83 v156.21,4.83
D2
  Bottom 0.406: U$1.2-OUT2 86.36,21.34 86.36,41.66 D2_.1
D3PWM
  Top 0.406: U$1.3-LRCLK2 93.98,31.5 R50.1
D4PWM
  Top 0.406: U$1.4-BCLK2 100.33,40.39 142.24,40.39 145.1,37.53 R47.1
D5PWM
  Top 0.406: U$1.5-IN2 99.06,41.66 113.03,41.66 138.11,66.74 R40.1
D6PWM  (via drill 0.35)
  Top 0.406: U$1.6-OUT1D 99.06,44.2 113.03,44.2 115.57,46.74 v115.57,56.9 | v115.57,63.25 115.57,64.78 116.52,65.73 R37.1
  Bottom 0.406: v115.57,56.9 v115.57,63.25
D7RX3
  Top 0.254: U$1.7-RX2/OUT1A 74.93,22.61 74.93,3.56 73.66,2.29 53.34,2.29 X2.3
D8TX3
  Top 0.254: U$1.8-TX2/IN1 73.66,23.88 73.66,4.83 72.39,3.56 57.15,3.56 X2.4
D9
  Bottom 0.406: U$1.9-OUT1C 85.09,37.85 D9_.1
D10
  Bottom 0.406: U$1.10-CS/MQSR 81.28,36.58 81.28,44.2 D10_.1
D11  (via drill 0.35)
  Top 0.406: U$1.11-MOSI/CTX1 v88.9,36.58 | v99.06,36.58 125.73,36.58 127,35.31 R41.1
  Top 0.61: R41.1 129.61,33.6 U5.8
  Bottom 0.406: v88.9,36.58 v99.06,36.58
D12  (via drill 0.35)
  Top 0.406: U$1.12-MIO/MQSL v91.44,39.12 | v101.6,39.12 129.54,39.12 130.81,37.85 R42.1
  Top 0.61: R42.1 134.94,32.45 135.25,32.14 U5.6
  Bottom 0.406: v91.44,39.12 v101.6,39.12
D14
  Top 0.406: U$1.14-A0/TX3/S-PFI_OUT 57.15,42.93 57.15,44.2 72.39,59.44 127,59.44 132.05,64.49 132.05,72.11 R31.1
  Top 0.61: R31.1 132.01,73.86 U4.8
D15
  Top 0.406: U$1.15-A1/RX3/S-PDIF_IN 55.88,41.66 55.88,45.47 71.12,60.71 118.43,60.71 127,69.28
  Top 0.61: 127,69.28 R32.1 126.68,75 126.37,75.32 U4.6
D16  (via drill 0.35)
  Top 0.406: U$1.16-A2/RX4/SCL1 54.61,40.39 54.61,46.74 69.85,61.98 v74.93,61.98 | R21.1 81.21,68.27 v78.74,65.79
  Top 0.61: R21.1 81.21,73.86 U3.8
  Bottom 0.406: v74.93,61.98 v78.74,65.79
D17  (via drill 0.35)
  Top 0.406: U$1.17-A3/TX4/SDA1 53.34,39.12 53.34,48.01 68.58,63.25 v71.12,63.25 | v73.66,65.79 75.88,68.01 R22.1
  Top 0.61: R22.1 75.88,75 75.56,75.32 U3.6
  Bottom 0.406: v71.12,63.25 v73.66,65.79
D18  (via drill 0.35)
  Top 0.406: U$1.18-A4/SDA0 52.07,37.85 v52.07,48.01 | v45.72,54.36 38.07,62.02 38.07,72.11 R3.1
  Top 0.508: 38.03,73.86 38.07,73.82 38.07,72.11
  Top 0.61: U1.8 38.03,73.86
  Bottom 0.406: v52.07,48.01 v45.72,54.36
D19  (via drill 0.35)
  Top 0.406: U$1.19-A5/SCL0 50.8,36.58 v50.8,46.74 | v44.45,53.09 32.86,64.68 32.86,69.44 R4.1 32.7,75
  Top 0.61: U1.6 32.38,75.32 32.7,75
  Bottom 0.406: v50.8,46.74 v44.45,53.09
D20PWM
  Top 0.406: U$1.20-A6/TX5/LRCLK1 49.53,35.31 49.53,53.09 60.96,64.52 88.9,64.52 94.93,70.55 R30.1
D21PWM
  Top 0.406: U$1.21-A7/RX5/BCLK1 48.26,34.04 48.26,54.36 65.72,71.82 R27.1
D22PWM
  Top 0.406: U$1.22-A8/CTX1 46.99,32.77 46.99,73.09 R12.1
D23PWM  (via drill 0.35)
  Top 0.406: U$1.23-A9/CRX1/CCLK1 45.72,31.5 45.72,42.93 v33.02,55.63 | v27.94,60.71 22.54,66.11 R9.1
  Bottom 0.406: v33.02,55.63 v27.94,60.71
GND
  Top 0.406: D2.C 20.63,3.64 12VOLT.GND
  Top 0.813: C4.2 30.48,45.45 U2.GND 30.48,28.96 31.71,27.73 34.91,27.73 36.22,26.42 D1.C
  Top 1.27: C3.2 14.01,39.14 C2.- 14.01,14.19 S8.P1
  pour Top (isolate 0.254): 0,107.7 173.25,107.7 173.25,1.55 170.18,-1.52 3.59,-1.52 arc-45 1.8,-0.77 0,1.02
  pour Bottom (isolate 0.254): 2.01,107.18 174.52,107.18 174.52,4.09 168.91,-1.52 4.86,-1.52 arc-45 3.07,-0.77 0,2.29 0,104.11 arc-45 0.74,105.91
N$2
  Top 0.406: R1.2 D1.A
N$3
  Top 0.406: R2.2 14.92,3.56 D2.A
N$5
  Top 0.61: J7.3 28.89,98.69 R5.2 R7.2
N$6
  Top 0.61: R7.1 35.75,94.96 D3.C
N$7
  Top 0.61: R5.1 27.73,87.91 27.73,87.69 31.11,84.31 U1.4
N$8  (via drill 0.35)
  Top 0.61: U1.2 33.66,84.21 34.8,85.35 v38.1,85.35 | v48.26,86.11 48.26,88.33 R6.1
  Bottom 0.61: v38.1,85.35 47.5,85.35 v48.26,86.11
N$10
  Top 0.61: Q2.1 R8.2 R9.2
N$11
  Top 0.61: J7.4 21.59,102.49 Q2.3
N$12
  Top 0.61: R10.2 R6.2 50.48,90.24 46.57,94.16 J8.3
N$18
  Top 0.61: D4.C 57.38,88.7 R10.1
N$25
  Top 0.61: R12.2 R11.2 Q4.1
N$28
  Top 0.61: Q4.3 43.18,102.49 J8.4
N$31
  Top 0.61: J10.3 72.07,98.69 R23.2 R25.2
N$32
  Top 0.61: R25.1 78.93,94.96 D5.C
N$33
  Top 0.61: R23.1 70.91,87.91 70.91,87.69 74.3,84.31 U3.4
N$34  (via drill 0.35)
  Top 0.61: U3.2 76.84,84.21 77.98,85.35 v81.28,85.35 | v99.06,86.11 99.06,88.33 R24.1
  Bottom 0.61: v99.06,86.11 98.55,86.62 82.55,86.62 v81.28,85.35
N$35
  Top 0.61: Q5.1 R26.2 R27.2
N$36
  Top 0.61: J10.4 64.77,102.49 Q5.3
N$37
  Top 0.61: R28.2 R24.2 101.28,90.24 97.37,94.16 J11.3
N$38
  Top 0.61: D6.C 108.18,88.7 R28.1
N$39
  Top 0.61: R30.2 R29.2 Q6.1
N$42
  Top 0.61: Q6.3 93.98,102.49 J11.4
N$45
  Top 0.61: J13.3 122.87,98.69 R33.2 R35.2
N$46
  Top 0.61: R35.1 129.73,94.96 D7.C
N$47
  Top 0.61: R33.1 121.71,87.91 121.71,87.69 125.09,84.31 U4.4
N$48  (via drill 0.35)
  Top 0.61: U4.2 127.63,84.21 128.78,85.35 v132.08,85.35 | v142.24,86.11 142.24,88.33 R34.1
  Bottom 0.61: v132.08,85.35 141.48,85.35 v142.24,86.11
N$49
  Top 0.61: Q7.1 R36.2 R37.2
N$50
  Top 0.61: J13.4 115.57,102.49 Q7.3
N$51
  Top 0.61: R38.2 R34.2 144.46,90.24 140.55,94.16 J14.3
N$52
  Top 0.61: D8.C 151.36,88.7 R38.1
N$53
  Top 0.61: R40.2 R39.2 Q8.1
N$56
  Top 0.61: Q8.3 137.16,102.49 J14.4
N$59
  Top 0.61: J16.3 138.75,7.5 R43.2 R45.2
N$60
  Top 0.61: R45.1 131.89,12.5 D9.C
N$61
  Top 0.61: R43.1 139.91,19.55 139.91,19.76 136.53,23.15 U5.4
N$62  (via drill 0.35)
  Top 0.61: U5.2 133.99,23.25 132.84,22.11 v129.54,22.11 | v119.38,21.34 119.38,19.12 R44.1
  Bottom 0.61: v129.54,22.11 120.14,22.11 v119.38,21.34
N$63
  Top 0.61: Q9.1 R46.2 R47.2
N$64
  Top 0.61: J16.4 146.05,3.7 Q9.3
N$65
  Top 0.61: R48.2 R44.2 117.16,17.21 121.07,13.3 J17.3
N$66
  Top 0.61: D10.C 110.26,18.76 R48.1
N$67
  Top 0.61: R50.2 R49.2 Q10.1
N$70
  Top 0.61: Q10.3 124.46,3.7 J17.4
RX
  Top 0.254: U$1.0-RX1 83.82,3.56 X1.1
TX
  Top 0.254: U$1.1-TX1 80.01,11.18 85.09,6.1 88.9,6.1 89.41,6.61 93.47,6.61 X1.2

### Text on the board
Top: Follow the white rabbit.
tPlace: PWM Sig G 12V | PWM Sig G 12V | PWM Sig G 12V | PWM Sig G 12V | PWM Sig G 12V | PWM Sig G 12V | Button 1 | Button 2 | Button 3 | Button 4 | Button 5 | Button 6 | ILD213T | ILD213T | ILD213T | Proto Area | Extra Pins | Expantion Headers | ILD213T | 5V | TEENSY 3.2 | Optional UART / To WavTrigger | Power Input | Button 8 | Button 7 | UART to / LED Board | PWM Sig G 12V | PWM Sig G 12V | 12V Vin
tNames: B1 | B2 | B3 | B4 | B5 | B6 | IRLML6344 N-CH | IRLML6344 N-CH | IRLML6344 N-CH | IRLML6344 N-CH | IRLML6344 N-CH | IRLML6344 N-CH | OMSI - SNOW / 8x Button IO Board / Daniel Smolentsev / 12/13/21 - V 1.1 | IRLML6344 N-CH | IRLML6344 N-CH | W1 | L1 | B8 | B7